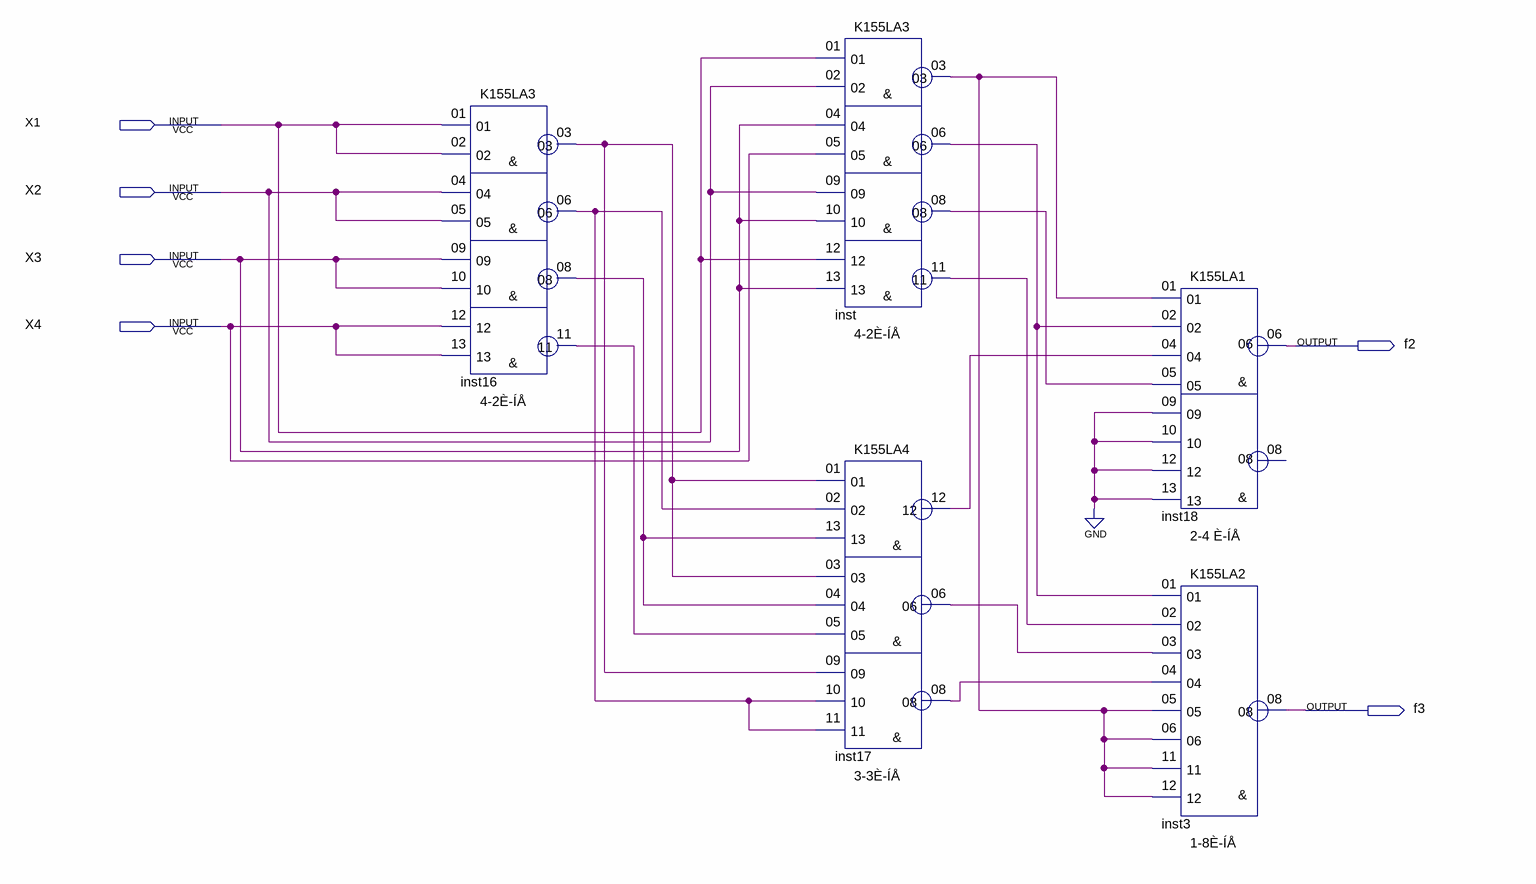
[diagram p0: schematic sheet]
// Quartus schematic lab1_2.bdf as structural Verilog: 5 symbols, 6 pins
module lab1_2 (
  input  X1,
  input  X2,
  input  X3,
  input  X4,
  output f2,
  output f3
);

  wire inst16_03, inst16_06, inst16_08, inst16_11, inst17_06, inst17_08, inst17_12, inst_03, inst_06,
       inst_08, inst_11;

  K155LA3 inst16 (
    .\01 (X1), .\02 (X1), .\04 (X2), .\05 (X2), .\09 (X3), .\10 (X3), .\12 (X4), .\13 (X4), .\03 (inst16_03),
    .\06 (inst16_06), .\08 (inst16_08), .\11 (inst16_11));
  K155LA3 inst (
    .\01 (X1), .\02 (X2), .\04 (X3), .\05 (X4), .\09 (X2), .\10 (X3), .\12 (X1), .\13 (X3), .\03 (inst_03),
    .\06 (inst_06), .\08 (inst_08), .\11 (inst_11));
  K155LA4 inst17 (
    .\01 (inst16_03), .\02 (inst16_06), .\13 (inst16_08), .\03 (inst16_03), .\04 (inst16_08),
    .\05 (inst16_11), .\09 (inst16_03), .\10 (inst16_06), .\11 (inst16_06), .\12 (inst17_12),
    .\06 (inst17_06), .\08 (inst17_08));
  K155LA1 inst18 (
    .\01 (inst_03), .\02 (inst_06), .\04 (inst17_12), .\05 (inst_08), .\09 (1'b0), .\10 (1'b0), .\12 (1'b0),
    .\13 (1'b0), .\06 (f2));  // open: 08
  K155LA2 inst3 (
    .\01 (inst_06), .\02 (inst_11), .\03 (inst17_06), .\04 (inst17_08), .\05 (inst_03), .\06 (inst_03),
    .\11 (inst_03), .\12 (inst_03), .\08 (f3));
endmodule
